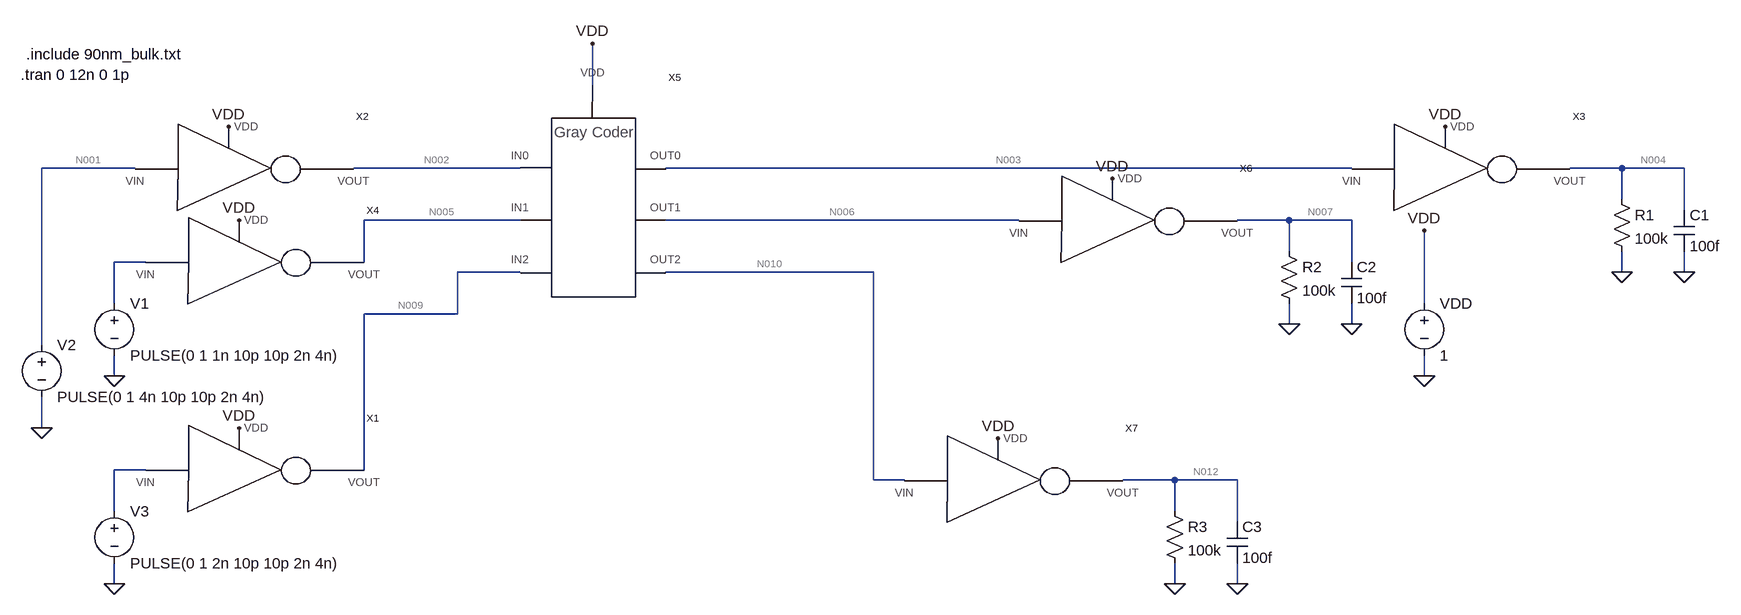
[diagram p0: schematic task_2.asc]
task_2.asc, the LTspice schematic file:
Version 4
SHEET 1 1740 1524
WIRE 0 464 0 400
WIRE -704 592 -848 592
WIRE -112 592 -368 592
WIRE 1168 592 112 592
WIRE 1584 592 1504 592
WIRE 1680 592 1584 592
WIRE 1584 640 1584 592
WIRE 1680 656 1680 592
WIRE -112 672 -352 672
WIRE 656 672 112 672
WIRE 1072 672 992 672
WIRE 1168 672 1072 672
WIRE 1072 720 1072 672
WIRE -688 736 -736 736
WIRE -352 736 -352 672
WIRE 1168 736 1168 672
WIRE -112 752 -208 752
WIRE 432 752 112 752
WIRE 1584 752 1584 720
WIRE 1680 752 1680 720
WIRE -736 800 -736 736
WIRE 1280 800 1280 688
WIRE -208 816 -208 752
WIRE -208 816 -352 816
WIRE 1072 832 1072 800
WIRE 1168 832 1168 800
WIRE -848 864 -848 592
WIRE -736 912 -736 880
WIRE 1280 912 1280 880
WIRE -848 992 -848 944
WIRE -688 1056 -736 1056
WIRE -352 1056 -352 816
WIRE 432 1072 432 752
WIRE 480 1072 432 1072
WIRE 896 1072 816 1072
WIRE 992 1072 896 1072
WIRE -736 1120 -736 1056
WIRE 896 1120 896 1072
WIRE 992 1136 992 1072
WIRE -736 1232 -736 1200
WIRE 896 1232 896 1200
WIRE 992 1232 992 1200
FLAG 0 400 VDD
FLAG 1280 688 VDD
FLAG 1280 912 0
FLAG -848 992 0
FLAG -736 912 0
FLAG 1584 752 0
FLAG 1680 752 0
FLAG -560 528 VDD
FLAG -544 672 VDD
FLAG 1312 528 VDD
FLAG -736 1232 0
FLAG -544 992 VDD
FLAG 1072 832 0
FLAG 1168 832 0
FLAG 800 608 VDD
FLAG 896 1232 0
FLAG 992 1232 0
FLAG 624 1008 VDD
SYMBOL voltage 1280 784 R0
WINDOW 123 0 0 Left 2
WINDOW 39 0 0 Left 2
SYMATTR InstName VDD
SYMATTR Value 1
SYMBOL voltage -848 848 R0
WINDOW 123 0 0 Left 2
WINDOW 39 0 0 Left 2
SYMATTR InstName V2
SYMATTR Value PULSE(0 1 4n 10p 10p 2n 4n)
SYMBOL voltage -736 784 R0
WINDOW 123 0 0 Left 2
WINDOW 39 0 0 Left 2
SYMATTR InstName V1
SYMATTR Value PULSE(0 1 1n 10p 10p 2n 4n)
SYMBOL res 1568 624 R0
SYMATTR InstName R1
SYMATTR Value 100k
SYMBOL cap 1664 656 R0
SYMATTR InstName C1
SYMATTR Value 100f
SYMBOL inverter -576 592 R0
SYMATTR InstName X2
SYMBOL inverter 1296 592 R0
SYMATTR InstName X3
SYMBOL inverter -560 736 R0
SYMATTR InstName X4
SYMBOL gray 0 672 R0
SYMATTR InstName X5
SYMBOL inverter -560 1056 R0
SYMATTR InstName X1
SYMBOL voltage -736 1104 R0
WINDOW 123 0 0 Left 2
WINDOW 39 0 0 Left 2
SYMATTR InstName V3
SYMATTR Value PULSE(0 1 2n 10p 10p 2n 4n)
SYMBOL res 1056 704 R0
SYMATTR InstName R2
SYMATTR Value 100k
SYMBOL cap 1152 736 R0
SYMATTR InstName C2
SYMATTR Value 100f
SYMBOL inverter 784 672 R0
SYMATTR InstName X6
SYMBOL res 880 1104 R0
SYMATTR InstName R3
SYMATTR Value 100k
SYMBOL cap 976 1136 R0
SYMATTR InstName C3
SYMATTR Value 100f
SYMBOL inverter 608 1072 R0
SYMATTR InstName X7
TEXT -880 448 Left 2 !.tran 0 12n 0 1p
TEXT -872 416 Left 2 !.include 90nm_bulk.txt

The netlist it stands for:
* task_2.asc
VDD VDD 0 1
V2 N001 0 PULSE(0 1 4n 10p 10p 2n 4n)
V1 N008 0 PULSE(0 1 1n 10p 10p 2n 4n)
R1 N004 0 100k
C1 N004 0 100f
XX2 N001 N002 VDD inverter  ; pins VIN VOUT VDD
XX3 N003 N004 VDD inverter  ; pins VIN VOUT VDD
XX4 N008 N005 VDD inverter  ; pins VIN VOUT VDD
XX5 N002 N005 N009 N003 N006 N010 VDD gray  ; pins IN0 IN1 IN2 OUT0 OUT1 OUT2 VDD
XX1 N011 N009 VDD inverter  ; pins VIN VOUT VDD
V3 N011 0 PULSE(0 1 2n 10p 10p 2n 4n)
R2 N007 0 100k
C2 N007 0 100f
XX6 N006 N007 VDD inverter  ; pins VIN VOUT VDD
R3 N012 0 100k
C3 N012 0 100f
XX7 N010 N012 VDD inverter  ; pins VIN VOUT VDD
.tran 0 12n 0 1p
.include 90nm_bulk.txt
.backanno
.end

* Results of the author's LTspice run, read from the files saved beside the schematic
* Operating Point, zero values left out:
*   V(vdd) = 1 V
*   V(n004) = 973.8 mV
*   V(n002) = 999.9 mV
*   V(n003) = 226.1 µV
*   V(n005) = 999.9 mV
*   V(n009) = 999.9 mV
*   V(n006) = 226.1 µV
*   V(n010) = 999.9 mV
*   V(n007) = 973.8 mV
*   V(n012) = 55.7 µV
*   I(R3) = 557 pA
*   I(R2) = 9.738 µA
*   I(R1) = 9.738 µA
*   I(V3) = 130.8 pA
*   I(V1) = 130.8 pA
*   I(V2) = 130.8 pA
*   I(Vdd) = -20.08 µA
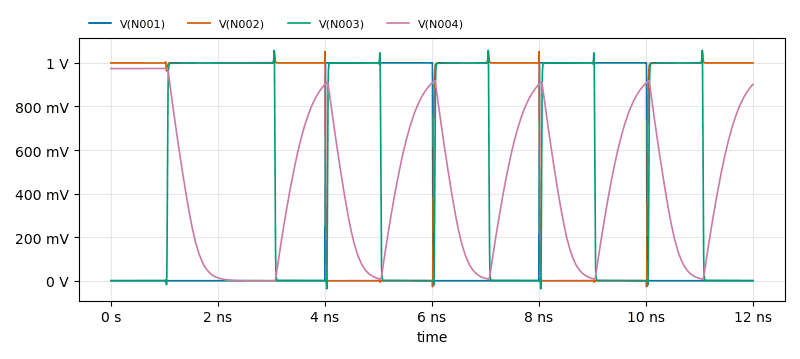
[diagram p1: Transient Analysis of task_2.asc, plotted from the saved traces]
* Transient Analysis, 1 run:
*   V(N001): min 0 V, max 1 V, average 335 mV, rms 578.3 mV, last 0 V
*   V(N002): min -27.34 mV, max 1.052 V, average 664.6 mV, rms 814.5 mV, last 999.9 mV
*   V(N003): min -37.13 mV, max 1.057 V, average 502.7 mV, rms 706.1 mV, last 500.1 µV
*   V(N004): min -633.6 µV, max 974.8 mV, average 447.4 mV, rms 569.4 mV, last 901.1 mV